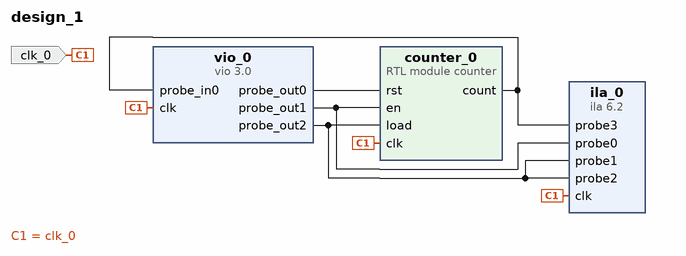
[diagram p0: block diagram of the top level]
# Vivado block design design_1, xc7k70tfbv676-1, Vivado 2024.1
create_bd_design design_1

create_bd_port -dir I -type clk clk_0

create_bd_cell -type module -reference counter counter_0
create_bd_cell -type ip -vlnv xilinx.com:ip:ila:6.2 ila_0
set_property -dict [list \
  CONFIG.ALL_PROBE_SAME_MU_CNT 2 \
  CONFIG.C_ADV_TRIGGER true \
  CONFIG.C_EN_STRG_QUAL 1 \
  CONFIG.C_MONITOR_TYPE Native \
  CONFIG.C_NUM_OF_PROBES 4 \
  CONFIG.C_PROBE2_WIDTH 4 \
  CONFIG.C_PROBE3_WIDTH 4 \
] [get_bd_cells ila_0]
create_bd_cell -type ip -vlnv xilinx.com:ip:vio:3.0 vio_0
set_property -dict {CONFIG.C_NUM_PROBE_OUT 3 CONFIG.C_PROBE_OUT2_WIDTH 4} [get_bd_cells vio_0]

# ---- connections ----

connect_bd_net -net clk_0_1 [get_bd_ports clk_0] [get_bd_pins ila_0/clk] [get_bd_pins vio_0/clk] [get_bd_pins counter_0/clk]
connect_bd_net [get_bd_pins counter_0/count] [get_bd_pins vio_0/probe_in0] [get_bd_pins ila_0/probe3]
connect_bd_net [get_bd_pins vio_0/probe_out0] [get_bd_pins counter_0/rst]
connect_bd_net [get_bd_pins vio_0/probe_out1] [get_bd_pins counter_0/en] [get_bd_pins ila_0/probe0]
connect_bd_net [get_bd_pins vio_0/probe_out2] [get_bd_pins counter_0/load] [get_bd_pins ila_0/probe2] [get_bd_pins ila_0/probe1]

validate_bd_design
save_bd_design
